# Altium schematic sheet as14120_fpga_ttl.SchDoc
size A3; PageSetup: Record=PageOptions|CenterHorizontal=True|CenterVertical=True|PrintScale=1.00|XCorrection=1.00|YCorrection=1.00|PrintKind=1|BorderSize=5000000|LeftOffset=0|BottomOffset=0|Orientation=2|PaperLength=1000|PaperWidth=1000|Scale=100|PaperSource=7|PrintQuality=-4|MediaType=1|DitherType=10|PaperKind=A4 (210 x 297 мм)|PrintScaleMode=1
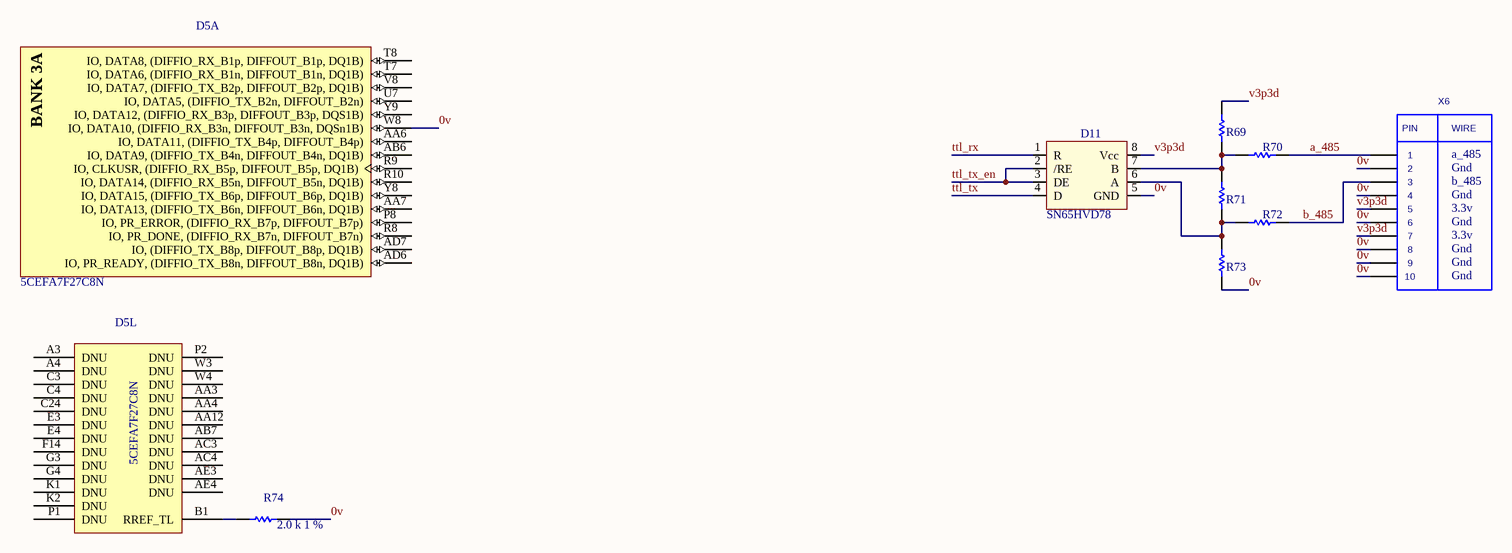
[diagram p0: as14120_fpga_ttl.SchDoc]

## Parts
D5  5CEFA7F27C8N  [ALTR-672-FBGA-2000A]  (parts A,L of 12)
D11  SN65HVD78  [8S1_M]
R69  1K 1% 0805(2012)  [RESC0805(2012)_L]  (value not drawn)
R70  1K 1% 0805(2012)  [RESC0805(2012)_L]  (value not drawn)
R71  1K 1% 0805(2012)  [RESC0805(2012)_L]  (value not drawn)
R72  1K 1% 0805(2012)  [RESC0805(2012)_L]  (value not drawn)
R73  1K 1% 0805(2012)  [RESC0805(2012)_L]  (value not drawn)
R74  value 2.0 k  Tolerance: 1 %  [RESC0805(2012)_L]  (hidden comment: 1K 1% 0805(2012))
X6  IDC10  [IDC10M]  (value not drawn)

## Nets
0v: D5.W8(IO,_DATA10,_(DIFFIO_RX_B3n,_DIFFOUT_B3n,_DQSn1B)) D11.5(GND) R73.1 R74.2 X6.2 X6.4 X6.6 X6.8 X6.9 X6.10
a_485: R70.2 X6.1
b_485: R72.2 X6.3
ttl_rx: D11.1(R)
ttl_tx: D11.4(D)
ttl_tx_en: D11.2(/RE) D11.3(DE)
v3p3d: D11.8(Vcc) R69.2 X6.5 X6.7
NetD5_B1: D5.B1(RREF_TL) R74.1
NetD11_6: D11.6(A) R71.1 R72.1 R73.2
NetD11_7: D11.7(B) R69.1 R70.1 R71.2

Not connected (* = marked no-connect by the designer): D5 A3(DNU) A4(DNU) AA3(DNU) AA4(DNU) AA6(IO,_DATA11,_(DIFFIO_TX_B4p,_DIFFOUT_B4p)) AA7(IO,_DATA13,_(DIFFIO_TX_B6n,_DIFFOUT_B6n,_DQ1B)) AA12(DNU) AB6(IO,_DATA9,_(DIFFIO_TX_B4n,_DIFFOUT_B4n,_DQ1B)) AB7(DNU) AC3(DNU) AC4(DNU) AD6(IO,_PR_READY,_(DIFFIO_TX_B8n,_DIFFOUT_B8n,_DQ1B)) AD7(IO,_(DIFFIO_TX_B8p,_DIFFOUT_B8p,_DQ1B)) AE3(DNU) AE4(DNU) C3(DNU) C4(DNU) C24(DNU) E3(DNU) E4(DNU) F14(DNU) G3(DNU) G4(DNU) K1(DNU) K2(DNU) P1(DNU) P2(DNU) P8(IO,_PR_ERROR,_(DIFFIO_RX_B7p,_DIFFOUT_B7p)) R8(IO,_PR_DONE,_(DIFFIO_RX_B7n,_DIFFOUT_B7n)) R9(IO,_CLKUSR,_(DIFFIO_RX_B5p,_DIFFOUT_B5p,_DQ1B)) R10(IO,_DATA14,_(DIFFIO_RX_B5n,_DIFFOUT_B5n,_DQ1B)) T7(IO,_DATA6,_(DIFFIO_RX_B1n,_DIFFOUT_B1n,_DQ1B)) T8(IO,_DATA8,_(DIFFIO_RX_B1p,_DIFFOUT_B1p,_DQ1B)) U7(IO,_DATA5,_(DIFFIO_TX_B2n,_DIFFOUT_B2n)) V8(IO,_DATA7,_(DIFFIO_TX_B2p,_DIFFOUT_B2p,_DQ1B)) W3(DNU) W4(DNU) Y8(IO,_DATA15,_(DIFFIO_TX_B6p,_DIFFOUT_B6p,_DQ1B)) Y9(IO,_DATA12,_(DIFFIO_RX_B3p,_DIFFOUT_B3p,_DQS1B))

## Notes on the sheet
- a_485
- b_485
- 3.3v
- Gnd
- Title
- Size:
- Date:
- A3
- Number:
- Time:
- Revision:
- Sheet
- of
- File:
- (in symbol 5CEFA7F27C8N, part A) BANK 3A
- (in symbol IDC10) PIN; WIRE

## Library data of the parts
D5 = 5CEFA7F27C8N: Cyclone V E Family FPGA, 1.07 to 1.13 V Supply, 336 I/O Pins, 7 PLLs, 672-Pin FBGA, Speed Grade 8, Commercial Grade, RoHS Compliant; Manufacturer: Altera; Device Group: 5CEFA7; GPIO: 336; Logic Elements (LE) (K): 149.5; Speed Grade: 8; DatasheetVersion: Rev. 3.1; PackageReference: 672-FBGA-2000A; PackageDescription: 672-Pin FineLine Ball-Grid Array (FBGA), Body 27 x 27 mm, Pitch 1 mm; Supplier 1: Digi-Key; Supplier Part Number 1: 5CEFA7F27C8N-ND; Supplier 2: Mouser; Supplier Part Number 2: 989-5CEFA7F27C8N; RoHS: RoHS Compliant; Subcategory: Cyclone V E; Voltage Supply: 1.07 to 1.13 V; Mounting Technology: Surface Mount; Code_JEDEC: MS-034-AAL-1; PartNumber: 5CEFA7F27C8N; ComponentLink1Description: Manufacturer URL; ComponentLink1URL: http://www.altera.com; ComponentLink2Description: Datasheet; ComponentLink2URL: http://www.altera.com/literature/hb/cyclone-v/cv_51002.pdf; ComponentLink3Description: Package Specification; ComponentLink3URL: http://www.altera.com/devicepackaging/04R00427-01.pdf; ComponentLink4Description: Device Handbook URL; ComponentLink4URL: http://www.altera.com/literature/hb/cyclone-v/cyclone5_handbook.pdf; ComponentLink5Description: Device Overview URL; ComponentLink5URL: http://www.altera.com/literature/hb/cyclone-v/cv_51001.pdf; ComponentLink6Description: Device Pin-Out URL; ComponentLink6URL: http://www.altera.com/literature/dp/cyclone-v/1.1.txt; ComponentLink7Description: Product URL; ComponentLink7URL: http://www.buyaltera.com/scripts/partsearch.dll?Detail&name=5CEFA7F27C8N-ND
R69 R73 = RES_0805: 1K 0.125W 1% 0805 (2012 Metric)  SMD; Case-Metric: 2012; Value: 1.1 k; Case-EIA: 0805; Tolerance: 1 %; Power: 0.125 W; Technology: SMT
R70 R72 = RES_0805: 1K 0.125W 1% 0805 (2012 Metric)  SMD; Case-Metric: 2012; Value: 33; Case-EIA: 0805; Tolerance: 1 %; Power: 0.125 W; Technology: SMT
R71 = RES_0805: 1K 0.125W 1% 0805 (2012 Metric)  SMD; Case-Metric: 2012; Value: 120; Case-EIA: 0805; Tolerance: 1 %; Power: 0.125 W; Technology: SMT
R74 = RES_0805: 1K 0.125W 1% 0805 (2012 Metric)  SMD; Case-Metric: 2012; Case-EIA: 0805; Power: 0.125 W; Technology: SMT
X6 = IDC10: Value: *